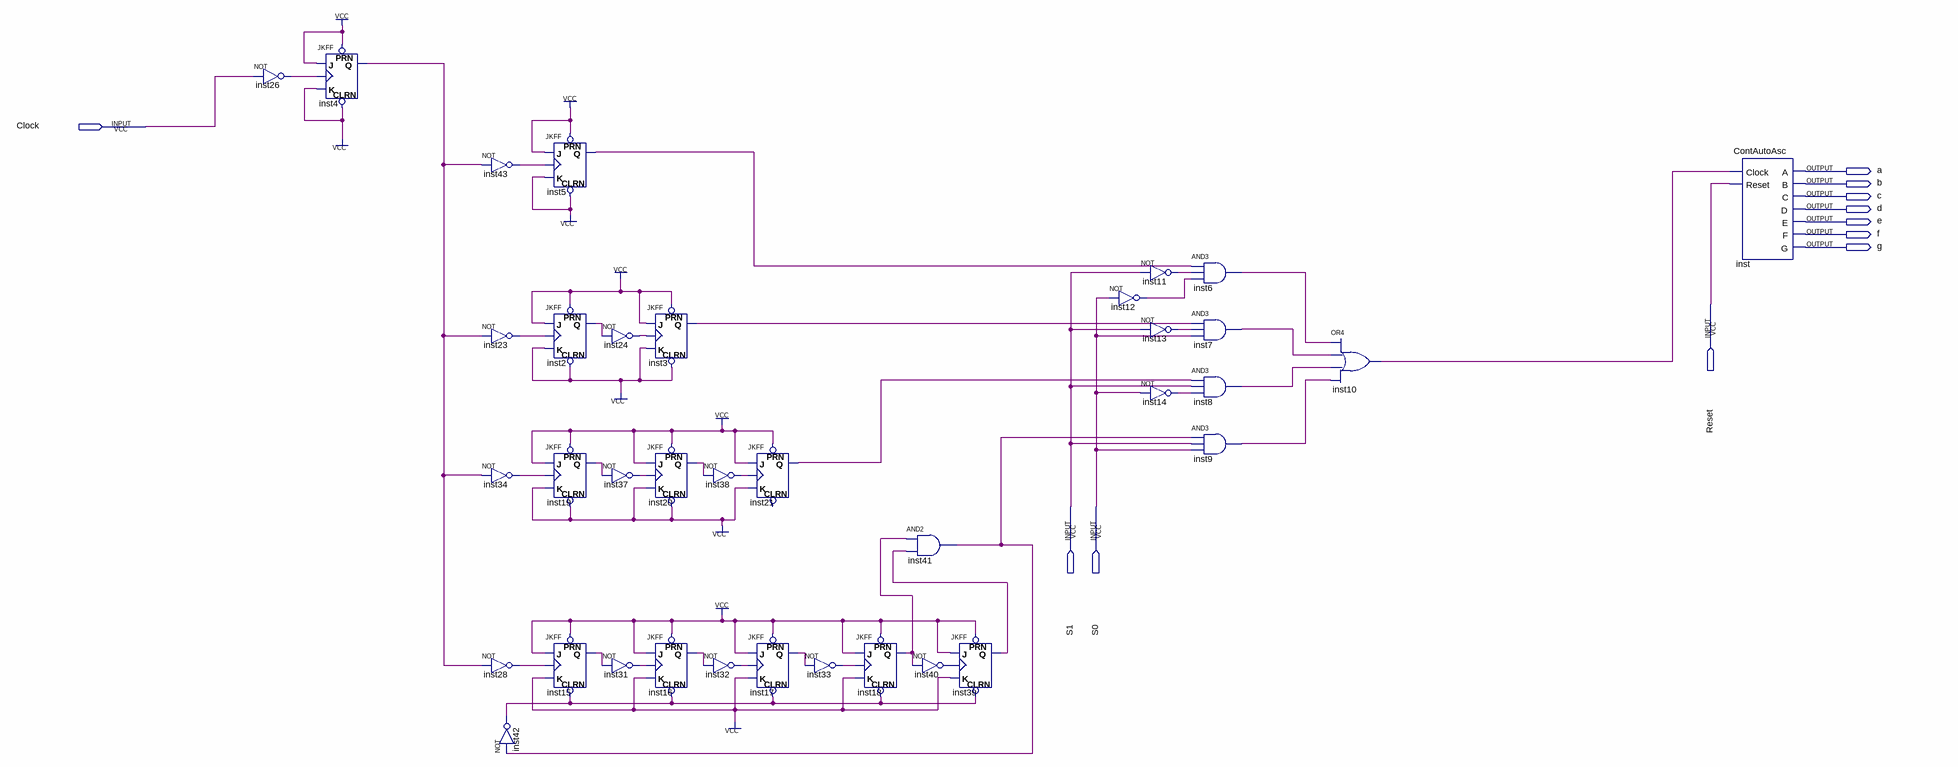
[diagram p0: schematic sheet]
// Quartus schematic ContSelecTempo.bdf as structural Verilog: 36 symbols, 11 pins
module ContSelecTempo (
  input  Clock,
  input  Reset,
  input  S1,
  input  S0,
  output a,
  output b,
  output c,
  output d,
  output e,
  output f,
  output g
);

  wire inst2_q, inst3_q, inst4_q, inst5_q, inst6_out, inst7_out, inst8_out, inst9_out, inst10_out,
       inst11_out, inst12_out, inst13_out, inst14_out, inst15_q, inst16_q, inst17_q, inst18_q, inst19_q,
       inst20_q, inst21_q, inst23_out, inst24_out, inst26_out, inst28_out, inst31_out, inst32_out,
       inst33_out, inst34_out, inst37_out, inst38_out, inst39_q, inst40_out, inst41_out, inst42_out,
       inst43_out;

  not inst26 (inst26_out, Clock);
  JKFF inst4 (.PRN(1'b1), .CLRN(1'b1), .K(1'b1), .J(1'b1), .CLK(inst26_out), .Q(inst4_q));
  not inst43 (inst43_out, inst4_q);
  not inst23 (inst23_out, inst4_q);
  not inst34 (inst34_out, inst4_q);
  not inst28 (inst28_out, inst4_q);
  not inst42 (inst42_out, inst41_out);
  JKFF inst5 (.PRN(1'b1), .CLRN(1'b1), .K(1'b1), .J(1'b1), .CLK(inst43_out), .Q(inst5_q));
  JKFF inst2 (.PRN(1'b1), .CLRN(1'b1), .K(1'b1), .J(1'b1), .CLK(inst23_out), .Q(inst2_q));
  JKFF inst19 (.PRN(1'b1), .CLRN(1'b1), .K(1'b1), .J(1'b1), .CLK(inst34_out), .Q(inst19_q));
  JKFF inst15 (.PRN(1'b1), .CLRN(inst42_out), .K(1'b1), .J(1'b1), .CLK(inst28_out), .Q(inst15_q));
  not inst24 (inst24_out, inst2_q);
  not inst37 (inst37_out, inst19_q);
  not inst31 (inst31_out, inst15_q);
  JKFF inst3 (.PRN(1'b1), .CLRN(1'b1), .K(1'b1), .J(1'b1), .CLK(inst24_out), .Q(inst3_q));
  JKFF inst20 (.PRN(1'b1), .CLRN(1'b1), .K(1'b1), .J(1'b1), .CLK(inst37_out), .Q(inst20_q));
  JKFF inst16 (.PRN(1'b1), .CLRN(inst42_out), .K(1'b1), .J(1'b1), .CLK(inst31_out), .Q(inst16_q));
  not inst38 (inst38_out, inst20_q);
  not inst32 (inst32_out, inst16_q);
  JKFF inst21 (.PRN(1'b1), .K(1'b1), .J(1'b1), .CLK(inst38_out), .Q(inst21_q));  // open: CLRN
  JKFF inst17 (.PRN(1'b1), .CLRN(inst42_out), .K(1'b1), .J(1'b1), .CLK(inst32_out), .Q(inst17_q));
  not inst33 (inst33_out, inst17_q);
  JKFF inst18 (.PRN(1'b1), .CLRN(inst42_out), .K(1'b1), .J(1'b1), .CLK(inst33_out), .Q(inst18_q));
  and inst41 (inst41_out, inst18_q, inst39_q);
  not inst40 (inst40_out, inst18_q);
  JKFF inst39 (.PRN(1'b1), .CLRN(inst42_out), .K(1'b1), .J(1'b1), .CLK(inst40_out), .Q(inst39_q));
  not inst12 (inst12_out, S0);
  not inst11 (inst11_out, S1);
  not inst13 (inst13_out, S1);
  not inst14 (inst14_out, S0);
  and inst6 (inst6_out, inst5_q, inst11_out, inst12_out);
  and inst7 (inst7_out, inst3_q, inst13_out, S0);
  and inst8 (inst8_out, inst21_q, S1, inst14_out);
  and inst9 (inst9_out, inst41_out, S1, S0);
  or inst10 (inst10_out, inst6_out, inst7_out, inst8_out, inst9_out);
  ContAutoAsc inst (.Clock(inst10_out), .Reset(Reset), .A(a), .B(b), .C(c), .D(d), .E(e), .F(f), .G(g));
endmodule
